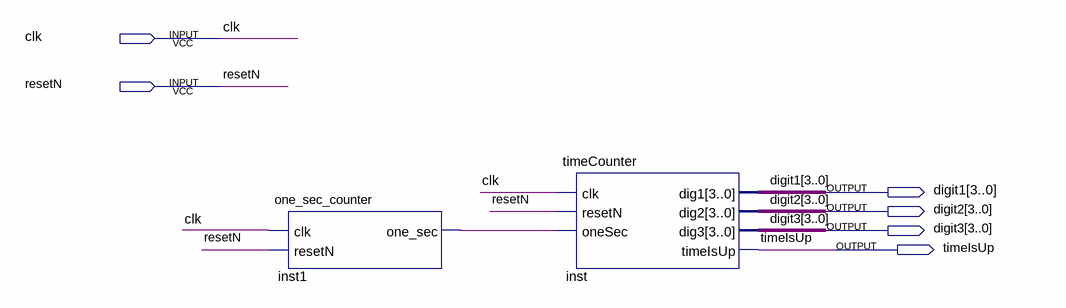
[diagram p0: schematic sheet]
// Quartus schematic Timer.bdf as structural Verilog: 2 symbols, 6 pins
module Timer (
  input  clk,
  input  resetN,
  output [3:0] digit1,
  output [3:0] digit2,
  output [3:0] digit3,
  output timeIsUp
);

  wire inst1_one_sec;

  one_sec_counter inst1 (.clk(clk), .resetN(resetN), .one_sec(inst1_one_sec));
  timeCounter inst (
    .clk(clk), .resetN(resetN), .oneSec(inst1_one_sec), .dig1(digit1), .dig2(digit2), .dig3(digit3),
    .timeIsUp(timeIsUp));
endmodule
